# EAGLE schematic fnordstripe (EAGLE 6.1)
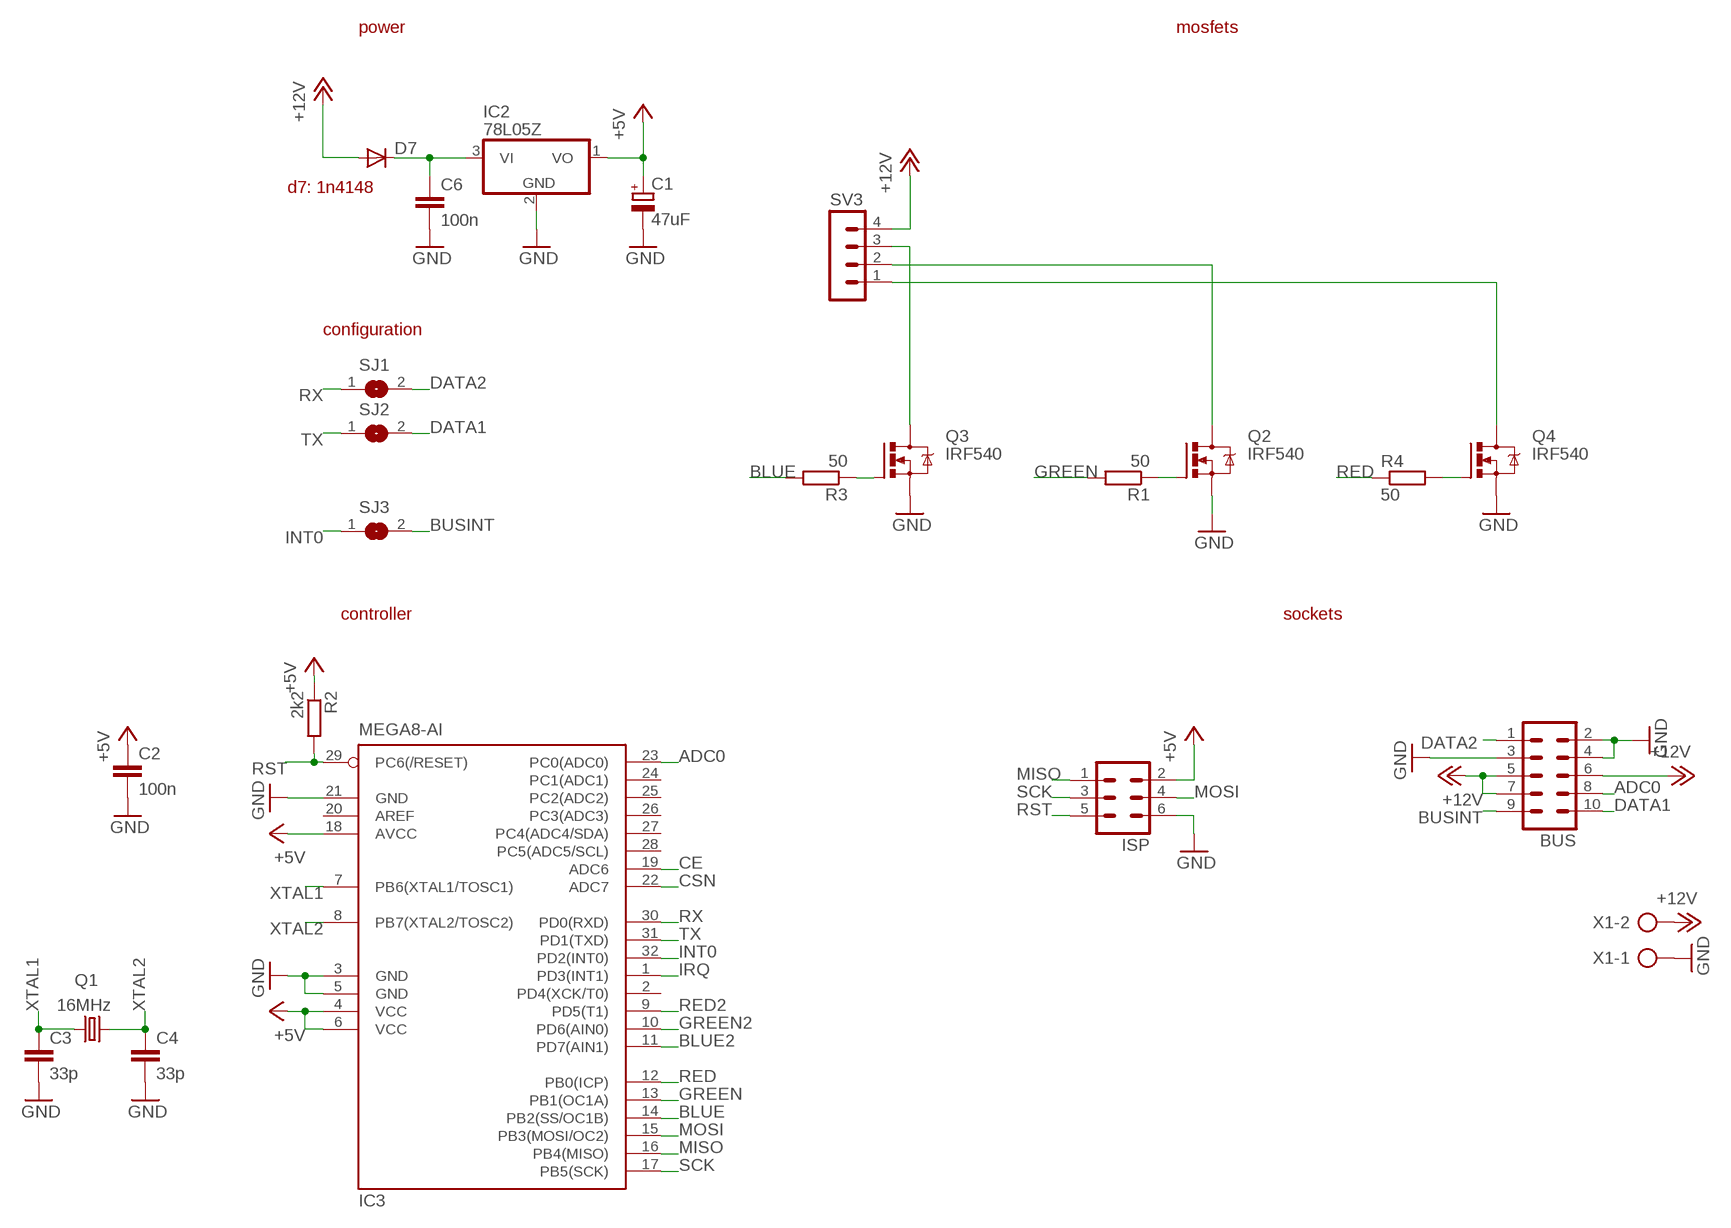
[diagram p0: schematic, sheet 1]

## Parts
BUS  MA05-2  [MA05-2]
C1  47uF  CPOL-EUE2-5  [E2-5]
C2  100n  C-EU025-024X044  [C025-024X044]
C3  33p  C-EU025-024X044  [C025-024X044]
C4  33p  C-EU025-024X044  [C025-024X044]
C6  100n  C-EU025-024X044  [C025-024X044]
D7  DIODE-D-2.5  [D-2.5]
IC2  78L05Z  [TO92]
IC3  MEGA8-AI  [TQFP32-08]
ISP  MA03-2  [MA03-2]
Q1  16MHz  CRYSTALHC49U-V  [HC49U-V]
Q2  IRF540  [TO220BV]
Q3  IRF540  [TO220BV]
Q4  IRF540  [TO220BV]
R1  50  R-EU_0204/2V  [0204V]
R2  2k2  R-EU_0204/2V  [0204V]
R3  50  R-EU_0204/2V  [0204V]
R4  50  R-EU_0204/2V  [0204V]
SJ1  SJ  [SJ]
SJ2  SJ  [SJ]
SJ3  SJ  [SJ]
SV3  MA04-1  [MA04-1]
X1  AK500/2  [AK500/2]

## Nets
+5V: C1.+ C2.1 IC2.1(VO) IC3.4(VCC) IC3.6(VCC) IC3.18(AVCC) ISP.2 R2.1
+12V: BUS.5 BUS.6 BUS.7 D7.A SV3.4 X1.2
ADC0: BUS.8 IC3.23(PC0(ADC0))
BLUE: IC3.14(PB2(SS/OC1B)) R3.2
BLUE2: IC3.11(PD7(AIN1))
BUSINT: BUS.9 SJ3.2
CE: IC3.19(ADC6)
CSN: IC3.22(ADC7)
DATA1: BUS.10 SJ2.2
DATA2: BUS.1 SJ1.2
GND: BUS.2 BUS.3 BUS.4 C1.- C2.2 C3.2 C4.2 C6.2 IC2.2(GND) IC3.3(GND) IC3.5(GND) IC3.21(GND) ISP.6 Q2.S Q3.S Q4.S X1.1
GREEN: IC3.13(PB1(OC1A)) R1.2
GREEN2: IC3.10(PD6(AIN0))
INT0: IC3.32(PD2(INT0)) SJ3.1
IRQ: IC3.1(PD3(INT1))
MISO: IC3.16(PB4(MISO)) ISP.1
MOSI: IC3.15(PB3(MOSI/OC2)) ISP.4
N$4: Q2.G R1.1
N$5: Q3.G R3.1
N$6: Q3.D SV3.3
N$7: Q4.G R4.2
N$8: Q2.D SV3.2
N$9: Q4.D SV3.1
N$22: C6.1 D7.C IC2.3(VI)
RED: IC3.12(PB0(ICP)) R4.1
RED2: IC3.9(PD5(T1))
RST: IC3.29(PC6(/RESET)) ISP.5 R2.2
RX: IC3.30(PD0(RXD)) SJ1.1
SCK: IC3.17(PB5(SCK)) ISP.3
TX: IC3.31(PD1(TXD)) SJ2.1
XTAL1: C3.1 IC3.7(PB6(XTAL1/TOSC1)) Q1.1
XTAL2: C4.1 IC3.8(PB7(XTAL2/TOSC2)) Q1.2
Unconnected: IC3.2(PD4(XCK/T0)) IC3.20(AREF) IC3.24(PC1(ADC1)) IC3.25(PC2(ADC2)) IC3.26(PC3(ADC3)) IC3.27(PC4(ADC4/SDA)) IC3.28(PC5(ADC5/SCL))

## Notes on the sheet
- power | mosfets
- d7: 1n4148
- configuration
- controller | sockets

## Library data of the parts
BUS = con-lstb:MA05-2: PIN HEADER
C1 = rcl:CPOL-EU: POLARIZED CAPACITOR, European symbol
C2-C4 C6 = rcl:C-EU: CAPACITOR, European symbol
D7 = diode:DIODE-: DIODE
IC2 = linear:78*: Positive VOLTAGE REGULATOR Source: http://cache.national.com/ds/LM/LM78L05.pdf http://www.fairchildsemi.com/ds/LM/LM7805.pdf
IC3 = atmel:MEGA8: MICROCONTROLLER 8 Kbytes FLASH, 1 kbytes SRAM, 512 bytes EEPROM, USART, 6-channel 10 bit ADC, 2-channel 8 bit ADC Pin compatible with Atmega48, ATMega88, ATMega168 Source: avr.lbr; MPN: ATMEGA8-16AU; OC_FARNELL: 9171371; OC_NEWARK: 73M8863
ISP = con-lstb:MA03-2: PIN HEADER; OC_FARNELL: unknown; OC_NEWARK: unknown
Q1 = crystal:CRYSTAL: CRYSTAL
Q2-Q4 = transistor-power:IRF540: HEXFET Power MOSFET
R1-R4 = rcl:R-EU_: RESISTOR, European symbol
SJ1-SJ3 = jumper:SJ: SMD solder JUMPER
SV3 = con-lstb:MA04-1: PIN HEADER; OC_FARNELL: unknown; OC_NEWARK: unknown
X1 = con-ptr500:AK500/2: CONNECTOR; OC_FARNELL: unknown; OC_NEWARK: unknown